# Altium schematic sheet LED_Controller.SchDoc
size A4; Organization: ENEL429 Group N; Address1: ECE Department; Address2: University of Canterbury; Address3: Christchurch 8041; Address4: New Zealand; Revision: 1
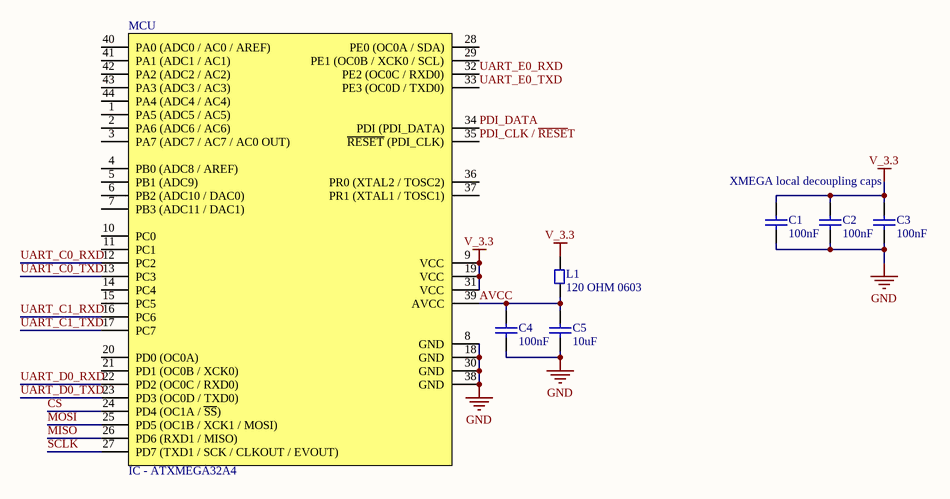
[diagram p0: LED_Controller.SchDoc]

## Parts
C1  100nF  [0603]
C2  100nF  [0603]
C3  100nF  [0603]
C4  100nF  [0603]
C5  10uF  [0603]
L1  120 OHM 0603  [0603]
MCU  IC - ATXMEGA32A4  [QFN50P700X700X100-44N]

## Nets
GND: C1.1 C2.1 C3.1 C4.1 C5.1 MCU.8(GND) MCU.18(GND) MCU.30(GND) MCU.38(GND)
V_3.3: C1.2 C2.2 C3.2 L1.2 MCU.9(VCC) MCU.19(VCC) MCU.31(VCC)
AVCC: C4.2 C5.2 L1.1 MCU.39(AVCC)
CS: MCU.24(PD4_(OC1A_/_~{SS}))
MISO: MCU.26(PD6_(RXD1_/_MISO))
MOSI: MCU.25(PD5_(OC1B_/_XCK1_/_MOSI))
PDI_CLK / ~{RESE}T: MCU.35(~{RESET}_(PDI_CLK))
PDI_DATA: MCU.34(PDI_(PDI_DATA))
SCLK: MCU.27(PD7_(TXD1_/_SCK_/_CLKOUT_/_EVOUT))
UART_C0_RXD: MCU.12(PC2)
UART_C0_TXD: MCU.13(PC3)
UART_C1_RXD: MCU.16(PC6)
UART_C1_TXD: MCU.17(PC7)
UART_D0_RXD: MCU.22(PD2_(OC0C_/_RXD0))
UART_D0_TXD: MCU.23(PD3_(OC0D_/_TXD0))
UART_E0_RXD: MCU.32(PE2_(OC0C_/_RXD0))
UART_E0_TXD: MCU.33(PE3_(OC0D_/_TXD0))

Not connected (* = marked no-connect by the designer): MCU 1(PA5_(ADC5_/_AC5)) 2(PA6_(ADC6_/_AC6)) 3(PA7_(ADC7_/_AC7_/_AC0_OUT)) 4(PB0_(ADC8_/_AREF)) 5(PB1_(ADC9)) 6(PB2_(ADC10_/_DAC0)) 7(PB3_(ADC11_/_DAC1)) 10(PC0) 11(PC1) 14(PC4) 15(PC5) 20(PD0_(OC0A)) 21(PD1_(OC0B_/_XCK0)) 28(PE0_(OC0A_/_SDA)) 29(PE1_(OC0B_/_XCK0_/_SCL)) 36(PR0_(XTAL2_/_TOSC2)) 37(PR1_(XTAL1_/_TOSC1)) 40(PA0_(ADC0_/_AC0_/_AREF)) 41(PA1_(ADC1_/_AC1)) 42(PA2_(ADC2_/_AC2)) 43(PA3_(ADC3_/_AC3)) 44(PA4_(ADC4_/_AC4))

## Notes on the sheet
- XMEGA local decoupling caps
- Title
- Drawn by:
- Date:
- Time:
- Revision:
- Sheet
- of
- File:

## Library data of the parts
C1-C4 = CP - 100nF 0603: CAP CER .10UF 50V X5R 0603; Manufacturer: AVX Corporation; Manufacturer Part Number: 06035D104KAT2A; Capacitance: 0.1µF; Tolerance: ±10%; Supplier 1: Digi-Key; RoHS: RoHS Compliant; Category: Capacitors; Stock 1: 0; Pricing 1: 10=0.33, 100=0.195, 500=0.1125, 1000=0.078 (USD); Voltage - Rated: 50V; Temperature Coefficient: X5R; Mounting Type: Surface Mount, MLCC; Operating Temperature: -55°C ~ 85°C; Applications: General Purpose; Ratings: -; Package / Case: 0603 (1608 Metric); Size / Dimension: 0.063" L x 0.032" W (1.60mm x 0.81mm); Height: -; Thickness: 0.035" (0.90mm); Lead Spacing: -; Features: -; Packaging: Cut Tape (CT); Lead Style: -; ComponentLink1URL: http://www.avx.com/docs/Catalogs/cx5r.pdf; ComponentLink1Description: http://www.avx.com/docs/Catalogs/cx5r.pdf; Supplier Part Number 1: 478-6206-1-ND
C5 = CP - 10uF 0603: CAP CER 10000PF 50V X7R 0603; Manufacturer: TDK Corporation; Manufacturer Part Number: C1608X7R1H103M; Tolerance: ±20%; Supplier 1: Digi-Key; RoHS: RoHS Compliant; Category: Capacitors; Stock 1: 7957; Pricing 1: 1=0.08, 10=0.05, 100=0.018, 250=0.013, 500=0.0096, 1000=0.0065 (USD); Capacitance: 10000pF; Voltage - Rated: 50V; Temperature Coefficient: X7R; Mounting Type: Surface Mount, MLCC; Operating Temperature: -55°C ~ 125°C; Applications: General Purpose; Ratings: -; Package / Case: 0603 (1608 Metric); Size / Dimension: 0.063" L x 0.031" W (1.60mm x 0.80mm); Height: -; Thickness: 0.037" (0.95mm); Lead Spacing: -; Features: -; Packaging: Cut Tape (CT); Lead Style: -; ComponentLink1URL: http://www.tdk.com/pdf/general_B11.pdf; ComponentLink1Description: http://www.tdk.com/pdf/general_B11.pdf; Supplier Part Number 1: 445-5090-1-ND
L1 = L - Ferrite Bead 120 Ohm 0603: FERRITE BEAD 120 OHM 0603; Manufacturer: Taiyo Yuden; Manufacturer Part Number: FBMH1608HL121-T; Impedance @ Frequency: 120 Ohm @ 100MHz; Current Rating: 900mA; DC Resistance (DCR): 130 mOhm Max; Filter Type: Differential Mode - Single; Number of Lines: 1; Supplier 1: Digi-Key; RoHS: RoHS Compliant; Category: Filters; Stock 1: 54571; Pricing 1: 1=0.38, 10=0.285, 50=0.1662, 100=0.133, 250=0.095, 500=0.0646, 1000=0.05225 (USD); Package / Case: 0603 (1608 Metric); Mounting Type: Surface Mount; Packaging: Cut Tape (CT); ComponentLink1URL: http://www.yuden.co.jp/us/product/pdf/chipbeads01_e.pdf; ComponentLink1Description: http://www.yuden.co.jp/us/product/pdf/chipbeads01_e.pdf; Supplier Part Number 1: 587-1731-1-ND
MCU = IC - ATXMEGA32A4: MCU AVR 32K FLASH 1.6V 44-QFN; Manufacturer: Atmel; Manufacturer Part Number: ATXMEGA32A4-MH; Core Size: 8/16-Bit; Speed: 32MHz; Connectivity: I²C, IrDA, SPI, UART/USART; Peripherals: Brown-out Detect/Reset, DMA, POR, PWM, WDT; Number of I /O: 34; Program Memory Size: 32KB (16K x 16); EEPROM Size: 2K x 8; RAM Size: 4K x 8; Voltage - Supply (Vcc/Vdd): 1.6 V ~ 3.6 V; Data Converters: A/D 12x12b, D/A 2x12b; Oscillator Type: Internal; Supplier 1: Digi-Key; RoHS: RoHS Compliant; Category: Integrated Circuits (ICs); Stock 1: 8846; Pricing 1: 1=5.88, 25=3.6908, 100=3.2808 (USD); Core Processor: AVR; Program Memory Type: FLASH; Operating Temperature: -40°C ~ 85°C; Package / Case: 44-VFQFN Exposed Pad; Packaging: Tray; ComponentLink1URL: http://www.atmel.com/dyn/resources/prod_documents/doc8069.pdf; ComponentLink1Description: http://www.atmel.com/dyn/resources/prod_documents/doc8069.pdf; Supplier Part Number 1: ATXMEGA32A4-MH-ND